# EAGLE design GaugeRev2 (EAGLE 6.4)
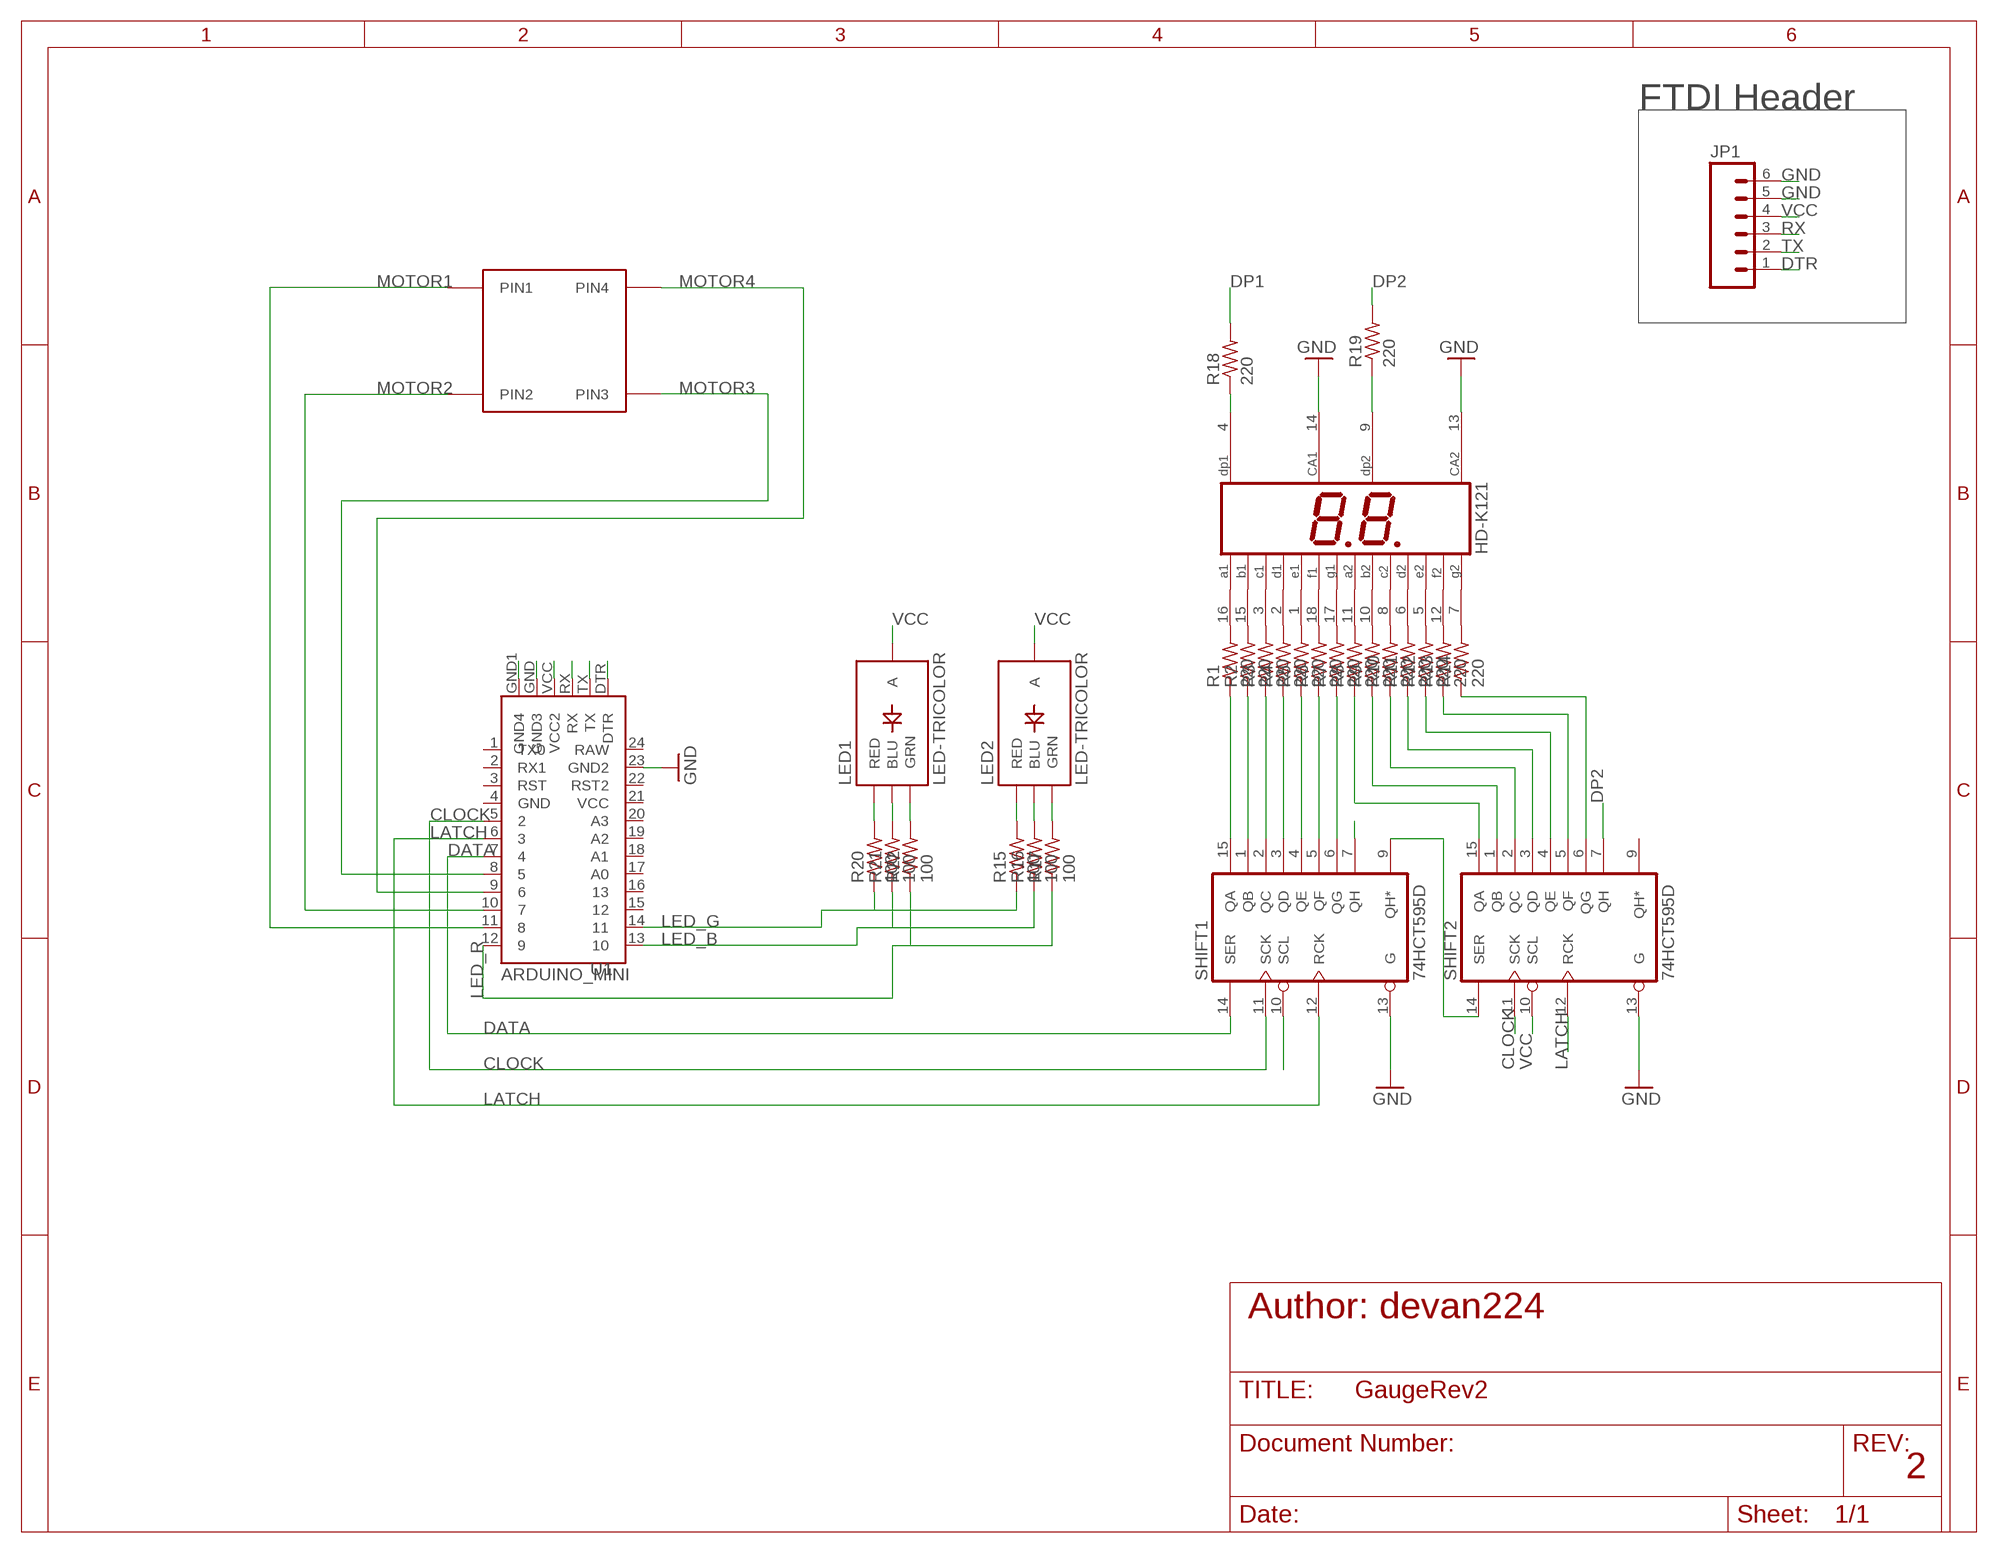
[diagram p0: schematic, sheet 1]

## Parts
DIS2  HD-K121  [HDSP-R]
JP1  M06SIP  [1X06]
LED1  LED-TRICOLOR  [LED-TRICOLOR-SMD]
LED2  LED-TRICOLOR  [LED-TRICOLOR-SMD]
R1  220  R-US_R1206  [R1206]
R2  220  R-US_R1206  [R1206]
R3  220  R-US_R1206  [R1206]
R4  220  R-US_R1206  [R1206]
R5  220  R-US_R1206  [R1206]
R6  220  R-US_R1206  [R1206]
R7  220  R-US_R1206  [R1206]
R8  220  R-US_R1206  [R1206]
R9  220  R-US_R1206  [R1206]
R10  220  R-US_R1206  [R1206]
R11  220  R-US_R1206  [R1206]
R12  220  R-US_R1206  [R1206]
R13  220  R-US_R1206  [R1206]
R14  220  R-US_R1206  [R1206]
R15  100  R-US_R1206  [R1206]
R16  100  R-US_R1206  [R1206]
R17  100  R-US_R1206  [R1206]
R18  220  R-US_R1206  [R1206]
R19  220  R-US_R1206  [R1206]
R20  100  R-US_R1206  [R1206]
R21  100  R-US_R1206  [R1206]
R22  100  R-US_R1206  [R1206]
SHIFT1  74HCT595D  [SO16]
SHIFT2  74HCT595D  [SO16]
U1  ARDUINO_MINI  [ARDUINO_MINI]
U2  VID29  [VID29]

## Nets
1: DIS2.4(DP1) R18.1
2: DIS2.9(DP2) R19.1
A1: R1.1 SHIFT1.15(QA)
A2: R8.1 SHIFT2.15(QA)
B1: R2.1 SHIFT1.1(QB)
B2: R9.1 SHIFT2.1(QB)
C1: R3.1 SHIFT1.2(QC)
CLOCK: SHIFT1.11(SCK) SHIFT2.11(SCK) U1.5
D1: R4.1 SHIFT1.3(QD)
DATA: SHIFT1.14(SER) U1.7
DP1: R18.2 SHIFT1.7(QH)
DP2: R19.2 SHIFT2.7(QH)
DTR: JP1.1 U1.DTR
E1: R5.1 SHIFT1.4(QE)
F1: R6.1 SHIFT1.5(QF)
G1: R7.1 SHIFT1.6(QG)
G2: R14.1 SHIFT2.6(QG)
GND: DIS2.13(CA2) DIS2.14(CA1) JP1.5 JP1.6 SHIFT1.13(G) SHIFT2.13(G) U1.23(GND2) U1.GND1(GND4) U1.GND(GND3)
LATCH: SHIFT1.12(RCK) SHIFT2.12(RCK) U1.6
LED_B: R16.1 R21.1 U1.13
LED_G: R15.1 R20.1 U1.14
LED_R: R17.1 R22.1 U1.12
MOTOR1: U1.11 U2.PIN1
MOTOR2: U1.10 U2.PIN2
MOTOR3: U1.8 U2.PIN3
MOTOR4: U1.9 U2.PIN4
N$1: DIS2.16(A1) R1.2
N$2: DIS2.15(B1) R2.2
N$3: DIS2.3(C1) R3.2
N$4: DIS2.2(D1) R4.2
N$5: DIS2.1(E1) R5.2
N$6: DIS2.18(F1) R6.2
N$7: DIS2.17(G1) R7.2
N$8: DIS2.11(A2) R8.2
N$9: DIS2.10(B2) R9.2
N$10: DIS2.8(C2) R10.2
N$11: DIS2.6(D2) R11.2
N$12: DIS2.5(E2) R12.2
N$13: DIS2.12(F2) R13.2
N$14: DIS2.7(G2) R14.2
N$15: LED2.G(GRN) R17.2
N$16: LED2.B(BLU) R16.2
N$19: R10.1 SHIFT2.2(QC)
N$20: R11.1 SHIFT2.3(QD)
N$21: R12.1 SHIFT2.4(QE)
N$22: R13.1 SHIFT2.5(QF)
N$23: LED2.R(RED) R15.2
N$24: LED1.G(GRN) R22.2
N$25: LED1.B(BLU) R21.2
N$26: LED1.R(RED) R20.2
Q*: SHIFT1.9(QH*) SHIFT2.14(SER)
RX: JP1.3 U1.RX
TX: JP1.2 U1.TX
VCC: JP1.4 LED1.A LED2.A SHIFT1.10(SCL) SHIFT2.10(SCL) U1.VCC(VCC2)
Unconnected: SHIFT2.9(QH*) U1.1(TX0) U1.2(RX1) U1.3(RST) U1.4(GND) U1.15 U1.16 U1.17(A0) U1.18(A1) U1.19(A2) U1.20(A3) U1.21(VCC) U1.22(RST2) U1.24(RAW)

## Notes on the sheet
- FTDI Header
- Author: devan224
- 2

## Power pins joined to a net without a drawn wire
GND: SHIFT1.8(GND) SHIFT2.8(GND)
VCC: SHIFT1.16(VCC) SHIFT2.16(VCC)

## Library data of the parts
DIS2 = HDSP-523E:HD-K121: LED DISPLAY 2 x 1 character 7 segment, decimal points right; OC_FARNELL: unknown; OC_NEWARK: unknown
JP1 = SparkFun:M06: Header 6 Standard 6-pin 0.1" header. Use with straight break away headers (SKU : PRT-00116), right angle break away headers (PRT-00553), swiss pins (PRT-00743), machine pins (PRT-00117), and female headers (PRT-00115). Molex polarized connector foot print use with SKU : PRT-08094 with associated crimp pins and housings. NOTES ON THE VARIANTS LOCK and LOCK_LONGPADS... This footprint was designed to help hold the alignment of a through-hole component (i.e. 6-pin header) while soldering it into place. You may notice that each hole has been shifted either up or down by 0.005 of an inch from it's more standard position (which is a perfectly straight line). This slight alteration caused the pins (the squares in the middle) to touch the edges of the holes. Because they are alternating, it causes a "brace" to hold the component in place. 0.005 has proven to be the perfect amount of "off-center" position when using our standard breakaway headers. Although looks a little odd when you look at the bare footprint, once you have a header in there, the alteration is very hard to notice. Also, if you push a header all the way into place, it is covered up entirely on the bottom side. This idea of altering the position of holes to aid alignment will be further integrated into the Sparkfun Library for other footprints. It can help hold any component with 3 or more connection pins.
LED1 LED2 = SparkFun:LED-TRICOLOR: Tri-Color LED SMD Proven layout and schematic for triple color LED in SMD package - common anode. Spark Fun Electronics SKU : COM-07844
R1-R22 = resistor:R-US_: RESISTOR, American symbol
SHIFT1 SHIFT2 = 74xx-eu:74*595: 8-bit SHIFT REGISTER, output latch
U1 = SparkFun:ARDUINO_MINI
U2 = Evans:VID29

## Board
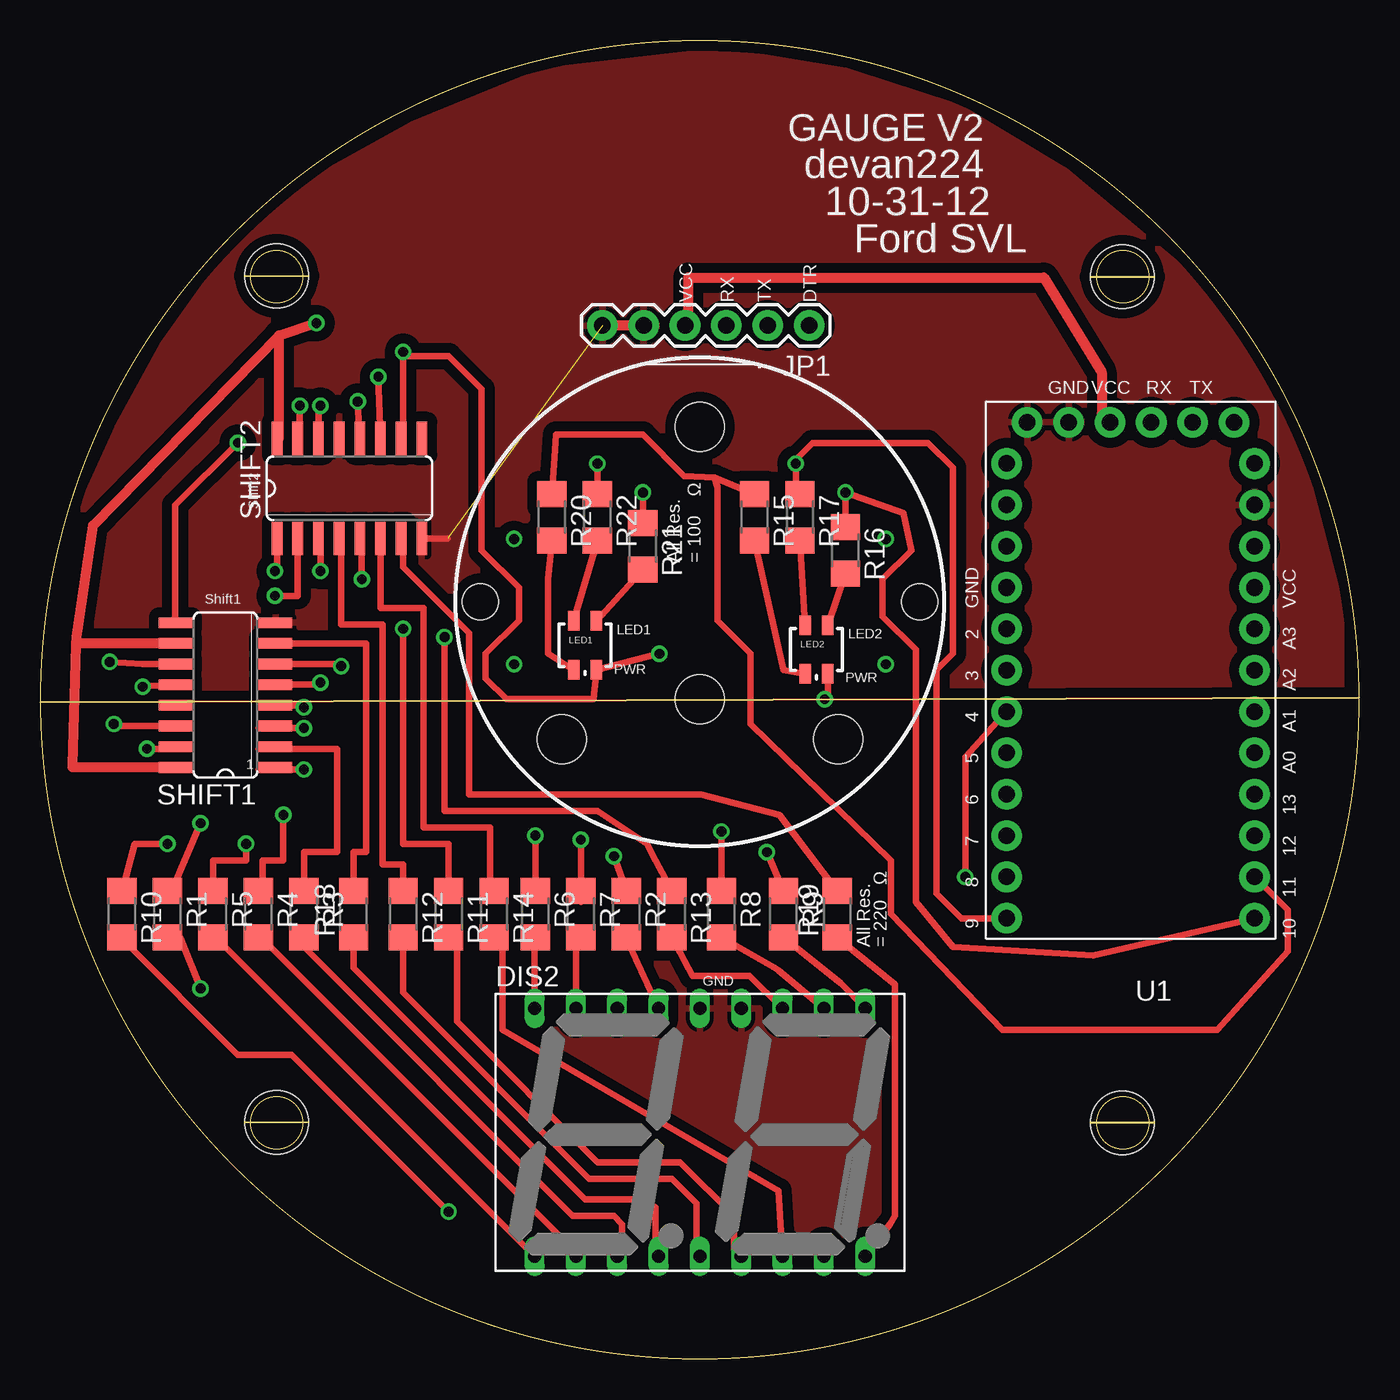
[diagram p1: board, top side]
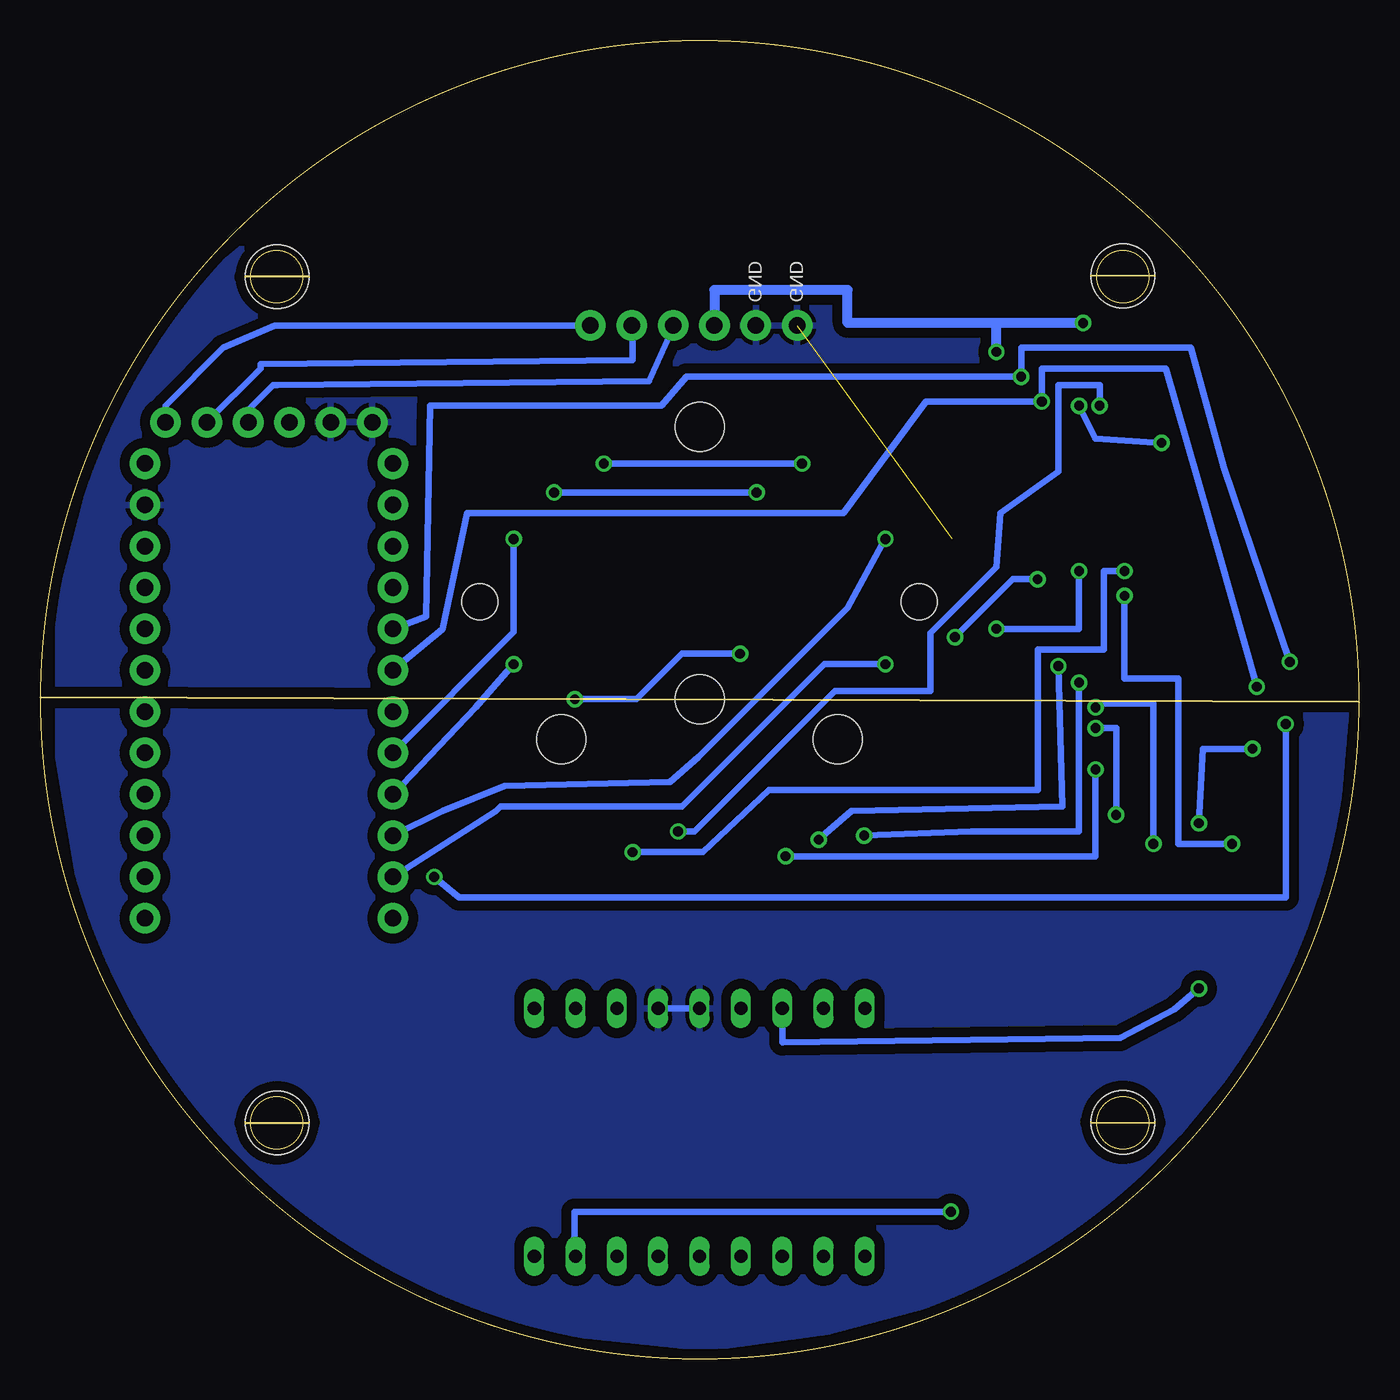
[diagram p2: board, bottom side, seen from below]

Size 81 x 81 mm. Coordinates in mm from the lower left corner, seen from the top.
Outline: circle at 66.5,66.5 radius 1.6
Outline: circle at 14.5,66.5 radius 1.6
Outline: circle at 66.5,14.5 radius 1.6
Outline: circle at 14.5,14.5 radius 1.6
Outline: circle at 40.5,40.5 radius 40.5
Copper layers (1*16): Top 0.0178mm / dielectric 59mil / Bottom 0.0178mm
Design rules: minimum track width 6mil, minimum drill 14mil, track to track 6mil, track to pad 6mil, pad to pad 6mil, via to via 6mil, smd to smd 6mil, copper to edge 20mil, drill to drill 16mil, minimum pad ring 8mil, minimum via ring 8mil, stop-mask expansion 3mil, vias tented up to drill 0mil, thermal gap 10mil
Holes 3.9 mm at 14.5,66.55 66.47,66.5 66.47,14.5 14.5,14.53

### Footprints (pad centres in the part's own frame; a part is rotated, then mirrored left to right if it is on the bottom)
HDSP-R = drill 0.813 long: 1 -10.16,-7.62; 2 -7.62,-7.62; 3 -5.08,-7.62; 4 -2.54,-7.62; 5 0,-7.62; 6 2.54,-7.62; 7 5.08,-7.62; 8 7.62,-7.62; 9 10.16,-7.62; 10 10.16,7.62; 11 7.62,7.62; 12 5.08,7.62; 13 2.54,7.62; 14 0,7.62; 15 -2.54,7.62; 16 -5.08,7.62; 17 -7.62,7.62; 18 -10.16,7.62
1X06 = drill 1.016 pad 1.88: 1 0,0; 2 2.54,0; 3 5.08,0; 4 7.62,0; 5 10.16,0; 6 12.7,0
LED-TRICOLOR-SMD = smd 0.7 x 1.2: A 0.7,-1.5; B 0.7,1.5; G -0.7,1.5; R -0.7,-1.5
R1206 = smd 1.6 x 1.803: 1 -1.422,0; 2 1.422,0
SO16 = smd 0.66 x 2.032: 1 -4.445,-3.073; 2 -3.175,-3.073; 3 -1.905,-3.073; 4 -0.635,-3.073; 5 0.635,-3.073; 6 1.905,-3.073; 7 3.175,-3.073; 8 4.445,-3.073; 9 4.445,3.073; 10 3.175,3.073; 11 1.905,3.073; 12 0.635,3.073; 13 -0.635,3.073; 14 -1.905,3.073; 15 -3.175,3.073; 16 -4.445,3.073
ARDUINO_MINI = drill 1.016 pad 1.88: 1 -7.62,12.7; 2 -7.62,10.16; 3 -7.62,7.62; 4 -7.62,5.08; 5 -7.62,2.54; 6 -7.62,0; 7 -7.62,-2.54; 8 -7.62,-5.08; 9 -7.62,-7.62; 10 -7.62,-10.16; 11 -7.62,-12.7; 12 -7.62,-15.24; 13 7.62,-15.24; 14 7.62,-12.7; 15 7.62,-10.16; 16 7.62,-7.62; 17 7.62,-5.08; 18 7.62,-2.54; 19 7.62,0; 20 7.62,2.54; 21 7.62,5.08; 22 7.62,7.62; 23 7.62,10.16; 24 7.62,12.7; DTR 6.35,15.24; GND -3.81,15.24; GND1 -6.35,15.24; RX 1.27,15.24; TX 3.81,15.24; VCC -1.27,15.24
VID29 = drill 0.6: PIN1 -11.425,-3.85; PIN2 -11.425,3.85; PIN3 11.425,3.85; PIN4 11.425,-3.85 | hole 2.2: 13.5,0; -13.5,0 | hole 3: 0,-6; 0,10.75; -8.5,-8.45; 8.5,-8.45

### Placement (x,y rotation side)
DIS2  40.51,13.92 0 top
JP1  47.22,63.5 180 top
LED1  33.45,43.84 0 top
LED2  47.67,43.58 0 top
R1  7.8,27.33 270 top
R2  35.99,27.33 270 top
R3  16.18,27.33 270 top
R4  13.38,27.33 270 top
R5  10.59,27.33 270 top
R6  30.4,27.33 270 top
R7  33.2,27.33 270 top
R8  41.83,27.33 270 top
R9  45.64,27.33 270 top
R10  5,27.33 270 top
R11  25.07,27.33 270 top
R12  22.27,27.33 270 top
R13  38.78,27.33 270 top
R14  27.86,27.33 270 top
R15  43.86,51.71 270 top
R16  49.45,49.68 270 top
R17  46.66,51.71 270 top
R18  19.23,27.33 90 top
R19  48.94,27.33 90 top
R20  31.42,51.71 270 top
R21  37.01,49.93 270 top
R22  34.21,51.71 270 top
SHIFT1  11.35,40.79 90 top
SHIFT2  18.97,53.49 0 top
U1  66.98,42.31 0 top
U2  40.51,46.53 0 top

### Tracks (layer width: path | path; a pad name or v marks a point on that pad's centre or on a via)
1
  Top 0.406: R18.1 19.23,24.03 33.45,9.8 37.01,9.8 37.77,9.29 37.77,6.5 DIS2.4
2
  Top 0.406: R19.1 52.5,23.01 52.5,8.79 52.19,8.28 DIS2.9
A1  (via drill 0.6)
  Top 0.406: R1.1 8.05,28.75 v9.83,32.92 | 7.26,37.49 SHIFT1.15 7.26,37.49 | v6.53,37.49 7.26,37.49
  Bottom 0.406: v9.83,32.92 9.57,37.49 v6.53,37.49
A2  (via drill 0.6)
  Top 0.406: R8.1 v41.83,32.41 | v15.92,58.57 15.92,56.69 SHIFT2.15
  Bottom 0.406: v41.83,32.41 40.82,32.41 37.77,35.46 37.51,35.71 32.18,41.04 26.34,41.04 26.34,44.6 22.27,48.66 22.02,51.97 18.46,54.51 18.46,59.84 15.92,59.84 v15.92,58.57
B1  (via drill 0.6)
  Top 0.406: R2.1 v35.23,30.88 | 13.41,36.22 SHIFT1.1 13.66,36.22 v16.18,36.22
  Bottom 0.406: v35.23,30.88 16.18,30.88 16.18,33.42 v16.18,36.22
B2  (via drill 0.6)
  Top 0.406: R9.1 v44.63,31.14 | v14.4,48.41 14.53,48.41 SHIFT2.1
  Bottom 0.406: v44.63,31.14 40.31,31.14 36.24,34.95 26.85,34.95 19.73,34.95 19.73,43.58 15.67,43.58 15.67,48.41 v14.4,48.41
C1
  Top 0.406: 16.18,37.49 15.67,37.49 | 15.67,37.49 13.41,37.49 SHIFT1.2 | R3.1 16.18,31.14 18.21,31.14 18.21,37.49 15.67,37.49
CLOCK  (via drill 0.6)
  Top 0.406: SHIFT1.11 6.27,42.7 v4.24,42.82 | v20.75,60.35 SHIFT2.11
  Bottom 0.406: v4.24,42.82 8.3,54.76 10.34,62.13 20.75,62.13 v20.75,60.35 41.32,60.35 42.85,58.57 57.07,58.57 57.33,45.62 U1.5
D1  (via drill 0.6)
  Top 0.406: v16.18,38.76 13.41,38.76 SHIFT1.3 | R4.1 13.64,28.75 13.64,30.63 14.91,30.63 v14.91,33.42
  Bottom 0.406: v14.91,33.42 14.91,38.76 v16.18,38.76
DATA  (via drill 0.6)
  Top 0.406: SHIFT1.14 4.49,38.89 v4.49,39.01 | v56.82,29.61 56.82,36.98 U1.7
  Bottom 0.406: v4.49,39.01 4.49,28.34 55.29,28.34 v56.82,29.61
DP1
  Top 0.406: SHIFT1.7 19.99,43.97 19.99,31.14 19.23,31.14 R18.2
DP2
  Top 0.406: R19.2 45.39,33.42 40.56,34.69 36.5,34.69 26.34,34.69 | 26.34,34.69 26.34,34.95 | 26.34,34.95 26.34,34.69 | 26.34,34.95 26.34,44.09 26.34,44.6 22.27,48.66 22.27,49.93 22.27,50.29 SHIFT2.7
DTR
  Bottom 0.406: JP1.1 66.62,63.5 69.77,62.13 73.33,58.57 U1.DTR
E1  (via drill 0.6)
  Top 0.406: SHIFT1.4 15.92,40.16 v16.18,40.03 | R5.1 10.59,30.63 12.62,30.63 v12.62,31.65
  Bottom 0.406: v12.62,31.65 12.62,34.19 12.62,40.28 16.18,40.28 v16.18,40.03
F1  (via drill 0.6)
  Top 0.406: SHIFT1.5 17.07,41.43 v17.19,41.55 | v30.4,32.15 R6.1
  Bottom 0.406: v17.19,41.55 17.19,32.41 23.8,32.41 v30.4,32.15
G1  (via drill 0.6)
  Top 0.406: R7.1 33.2,28.09 R7.1 | SHIFT1.6 18.46,42.7 v18.46,42.57 | v33.2,31.9 33.2,31.39 R7.1
  Bottom 0.406: v18.46,42.57 18.21,33.93 31.16,33.68 v33.2,31.9
G2
  Top 0.406: R14.1 27.61,28.75 27.61,32.66 23.54,32.66 23.54,46.12 20.88,46.12 SHIFT2.6
GND  (1 unrouted)
  Top 0.406: SHIFT2.8 25.01,50.42
  Top 0.61: JP1.5 JP1.6
  Bottom 0.406: DIS2.14 DIS2.13
  pour Bottom (isolate 0.61): 4.75,57.3 7.54,62.38 11.35,67.71 15.92,72.03 22.78,75.84 30.91,79.14 41.83,80.41 49.45,79.14 56.56,76.86 62.91,73.05 70.79,66.44 74.09,61.87 77.39,55.78 79.93,46.12 79.93,36.98 78.41,28.09 76.38,22.76 71.55,15.14 65.71,9.55 58.6,4.72 49.71,1.67 40.05,0.66 32.69,1.67 24.05,3.96 18.97,6.75 15.16,9.55 11.1,13.87 6.27,19.71 3.99,24.53 1.45,32.15 0.68,41.04 1.95,51.2
  pour Top (isolate 0.61): 4.75,57.3 7.54,62.38 11.35,67.71 15.92,72.03 22.78,75.84 30.91,79.14 41.83,80.41 49.45,79.14 56.56,76.86 62.91,73.05 70.79,66.44 74.09,61.87 77.39,55.78 79.93,46.12 79.93,36.98 78.41,28.09 76.38,22.76 71.55,15.14 65.71,9.55 58.6,4.72 49.71,1.67 40.05,0.66 32.69,1.67 24.05,3.96 18.97,6.75 15.16,9.55 11.1,13.87 6.27,19.71 3.99,24.53 1.45,32.15 0.68,41.04 1.95,51.2
LATCH  (via drill 0.6)
  Top 0.406: SHIFT1.12 v6.27,41.3 | v19.48,58.82 SHIFT2.12
  Bottom 0.406: v6.27,41.3 8.56,49.43 11.86,60.86 19.48,60.86 v19.48,58.82 26.59,58.82 31.67,51.97 54.79,51.97 56.31,44.85 U1.6
LED_B  (via drill 0.6)
  Top 0.406: U1.13 64.69,24.79 56.06,25.3 53.77,28.09 53.77,39.77 53.77,41.04 53.77,43.58 51.74,45.62 51.74,47.9 53.52,49.68 53.01,51.97 v49.45,53.24 R16.1 | v37.01,53.24 R21.1
  Bottom 0.406: v49.45,53.24 v37.01,53.24
LED_G
  Top 0.406: R20.1 31.67,56.79 37.01,56.79 39.55,54.25 41.41,54.16 | 41.41,54.16 43.61,53.24 R15.1 | U1.14 76.63,27.58 76.63,25.04 72.31,20.22 59.1,20.22 52.25,27.33 52.25,30.63 43.61,39.01 43.61,43.33 41.58,45.36 41.58,51.97 41.58,53.56 41.41,54.16
LED_R  (via drill 0.6)
  Top 0.406: U1.12 56.56,27.07 55.04,28.6 55.04,42.31 56.06,43.33 56.06,54.76 54.53,56.28 47.42,56.28 46.4,55.27 | 46.4,55.27 v46.4,55.01 | v46.4,55.01 46.4,53.39 R17.1 | R22.1 v34.21,55.01 | v46.4,55.01 46.4,55.27
  Bottom 0.406: v34.21,55.01 v46.4,55.01
MOTOR1
  Bottom 0.406: U2.PIN1 32.83,42.68 41.58,33.93 52.75,33.93 53.01,33.68 U1.11
MOTOR2
  Bottom 0.406: U2.PIN2 29.13,50.38 31.42,46.12 40.56,36.98 42.34,35.46 52.5,35.2 56.31,33.68 U1.10
MOTOR3
  Bottom 0.406: U2.PIN3 51.94,44.66 U1.8
MOTOR4
  Bottom 0.406: U2.PIN4 54.28,40.03 U1.9
N$1  (via drill 0.6)
  Top 0.406: R1.2 8.56,25.91 v9.83,22.76
  Bottom 0.406: v9.83,22.76 11.35,21.49 14.65,19.71 35.43,19.45 DIS2.16
N$2
  Top 0.406: R2.2 36.19,25.4 DIS2.15
N$3
  Top 0.406: R3.2 16.18,25.3 32.69,8.79 35.23,8.79 35.74,8.28 35.74,6.6 DIS2.3
N$4
  Top 0.406: R4.2 13.54,25.91 32.18,7.26 32.18,7.01 DIS2.2
N$5
  Top 0.406: R5.2 10.74,25.91 DIS2.1
N$6
  Top 0.406: R6.2 30.35,25.91 DIS2.18
N$7
  Top 0.406: R7.2 32.89,25.91 DIS2.17
N$8
  Top 0.406: DIS2.11 45.34,23.87 45.13,24.03 R8.2
N$9
  Top 0.406: R9.2 49.15,23.11 DIS2.10
N$10  (via drill 0.6)
  Top 0.406: R10.2 5,25.8 12.11,18.69 15.42,18.69 v25.07,9.04
  Bottom 0.406: v25.07,9.04 48.18,9.04 48.18,6.35 DIS2.8
N$11
  Top 0.406: R11.2 25.58,25.91 25.58,20.72 34.21,12.09 39.29,12.09 42.59,8.79 42.59,6.75 DIS2.6
N$12
  Top 0.406: R12.2 22.27,22.5 33.7,11.07 38.78,11.07 40.31,9.55 40.31,6.5 DIS2.5
N$13
  Top 0.406: DIS2.12 43.56,23.52 40.05,23.52 R13.2
N$14
  Top 0.406: R14.2 28.37,25.91 28.37,20.22 45.34,10.31 DIS2.7
N$15
  Top 0.406: R17.2 LED2.G
N$16
  Top 0.406: R16.2 LED2.B
N$19  (via drill 0.6)
  Top 0.406: R10.1 5.76,31.65 v7.8,31.65 | v14.4,46.89 15.8,46.89 SHIFT2.2
  Bottom 0.406: v14.4,46.89 14.4,41.81 11.1,41.81 11.1,31.65 v7.8,31.65
N$20  (via drill 0.6)
  Top 0.406: R11.1 25.07,30.12 25.07,30.88 25.07,31.65 22.27,31.65 v22.27,44.85 | v17.19,48.41 17.19,50.29 SHIFT2.3
  Bottom 0.406: v17.19,48.41 17.19,44.85 v22.27,44.85
N$21
  Top 0.406: R12.1 22.27,30.38 21,30.38 21,40.28 21,45.11 18.46,45.11 18.46,50.29 SHIFT2.4
N$22  (via drill 0.6)
  Top 0.406: v24.81,44.35 24.81,33.68 34.21,33.68 37.26,31.65 37.77,30.63 R13.1 | v19.73,47.9 19.73,50.29 SHIFT2.5
  Bottom 0.406: v24.81,44.35 21.26,47.9 v19.73,47.9
N$23
  Top 0.406: LED2.R 45.64,42.31 R15.2
N$24
  Top 0.406: R22.2 LED1.G
N$25
  Top 0.406: R21.2 LED1.B
N$26
  Top 0.406: R20.2 31.16,47.9 31.16,43.33 LED1.R
Q*  (via drill 0.6)
  Top 0.406: SHIFT1.9 8.28,52.45 v12.11,56.28 | v17.19,58.57 17.07,58.57 SHIFT2.14
  Bottom 0.406: v12.11,56.28 16.18,56.54 v17.19,58.57
RX
  Bottom 0.406: JP1.3 42.09,63.5 43.61,60.09 66.47,59.84 66.72,59.84 68.5,58.06 68.5,57.81 U1.RX
TX
  Bottom 0.406: JP1.2 44.63,63.5 44.63,61.36 67.49,61.11 67.49,60.86 U1.TX
VCC  (via drill 0.6)
  Top 0.406: SHIFT2.16 14.65,56.56 | SHIFT2.10 22.27,56.56 v22.27,61.87 22.53,61.62 25.07,61.62 27.1,59.59 27.1,57.81 27.1,49.68 29.39,47.39 29.39,45.36 27.35,43.33 27.35,41.81 28.62,40.54 33.96,40.54 34.13,41.97 34.13,42.31 | LED2.A 48.37,40.73 v48.18,40.54 | v38.02,43.33 34.13,42.31 | 34.13,42.31 LED1.A
  Top 0.61: SHIFT1.16 3.35,36.35 1.95,36.35 1.95,36.47 2.19,43.86 | 2.19,43.86 2.21,44.35 3.22,51.2 14.65,62.89 | SHIFT1.10 3.22,43.97 2.19,43.97 2.19,43.86 | 14.65,56.56 14.65,62.89 | 14.65,62.89 v16.94,63.65 | JP1.4 39.8,63.5 39.8,66.44 61.64,66.44 65.2,60.6 65.2,58.06 U1.VCC
  Bottom 0.406: v48.18,40.54 44.37,40.54 41.58,43.33 v38.02,43.33
  Bottom 0.61: v22.27,61.87 22.27,63.65 | 22.27,63.65 31.42,63.65 31.42,65.68 39.6,65.68 JP1.4 | v16.94,63.65 22.27,63.65

### Text on the board
tPlace: GAUGE V2 | devan224 | 10-31-12 | Ford SVL | VCC | RX | TX | DTR | Ω | Shift2 | All Res. | = 100 | Shift1 | LED1 | LED2 | PWR | PWR | 1 | Ω | All Res. | = 220 | GND
bPlace: GND | GND